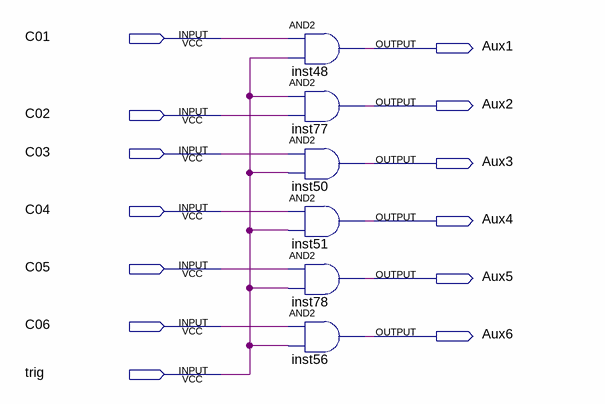
[diagram p0: schematic sheet]
// Quartus schematic AUX_trig.bdf as structural Verilog: 6 symbols, 13 pins
module AUX_trig (
  input  C01,
  input  C02,
  input  C03,
  input  C04,
  input  C05,
  input  C06,
  input  trig,
  output Aux1,
  output Aux2,
  output Aux3,
  output Aux4,
  output Aux5,
  output Aux6
);

  and inst48 (Aux1, C01, trig);
  and inst77 (Aux2, trig, C02);
  and inst50 (Aux3, C03, trig);
  and inst51 (Aux4, C04, trig);
  and inst78 (Aux5, C05, trig);
  and inst56 (Aux6, C06, trig);
endmodule
